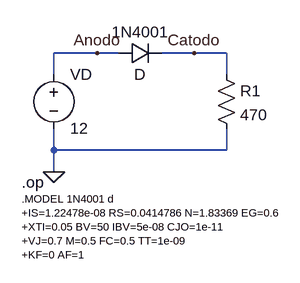
[diagram p0: schematic Diodo 1N4001 (simple application).asc]
Diodo 1N4001 (simple application).asc, the LTspice schematic file:
Version 4
SHEET 1 880 680
WIRE 192 80 128 80
WIRE 224 80 192 80
WIRE 336 80 288 80
WIRE 384 80 336 80
WIRE 128 112 128 80
WIRE 384 112 384 80
WIRE 128 224 128 192
WIRE 384 224 384 192
WIRE 384 224 128 224
WIRE 128 256 128 224
FLAG 128 256 0
FLAG 192 80 Anodo
FLAG 336 80 Catodo
SYMBOL diode 224 96 R270
WINDOW 0 32 32 VTop 2
WINDOW 3 0 32 VBottom 2
SYMATTR InstName 1N4001
SYMBOL voltage 128 96 R0
WINDOW 123 0 0 Left 0
WINDOW 39 0 0 Left 0
SYMATTR InstName VD
SYMATTR Value 12
SYMBOL res 368 96 R0
SYMATTR InstName R1
SYMATTR Value 470
TEXT 80 296 Left 1 !.MODEL 1N4001 d\n+IS=1.22478e-08 RS=0.0414786 N=1.83369 EG=0.6\n+XTI=0.05 BV=50 IBV=5e-08 CJO=1e-11\n+VJ=0.7 M=0.5 FC=0.5 TT=1e-09\n+KF=0 AF=1
TEXT 80 272 Left 2 !.op

The netlist it stands for:
* Diodo 1N4001 (simple application).asc
D§1N4001 Anodo Catodo D
VD Anodo 0 12
R1 Catodo 0 470
.model D D
.lib standard.dio
.MODEL 1N4001 d
+IS=1.22478e-08 RS=0.0414786 N=1.83369 EG=0.6
+XTI=0.05 BV=50 IBV=5e-08 CJO=1e-11
+VJ=0.7 M=0.5 FC=0.5 TT=1e-09
+KF=0 AF=1
.op
.backanno
.end